# Altium schematic sheet Sheet1.SchDoc (part 1 of 3)
size C; SheetNumber: 1; SheetTotal: 1
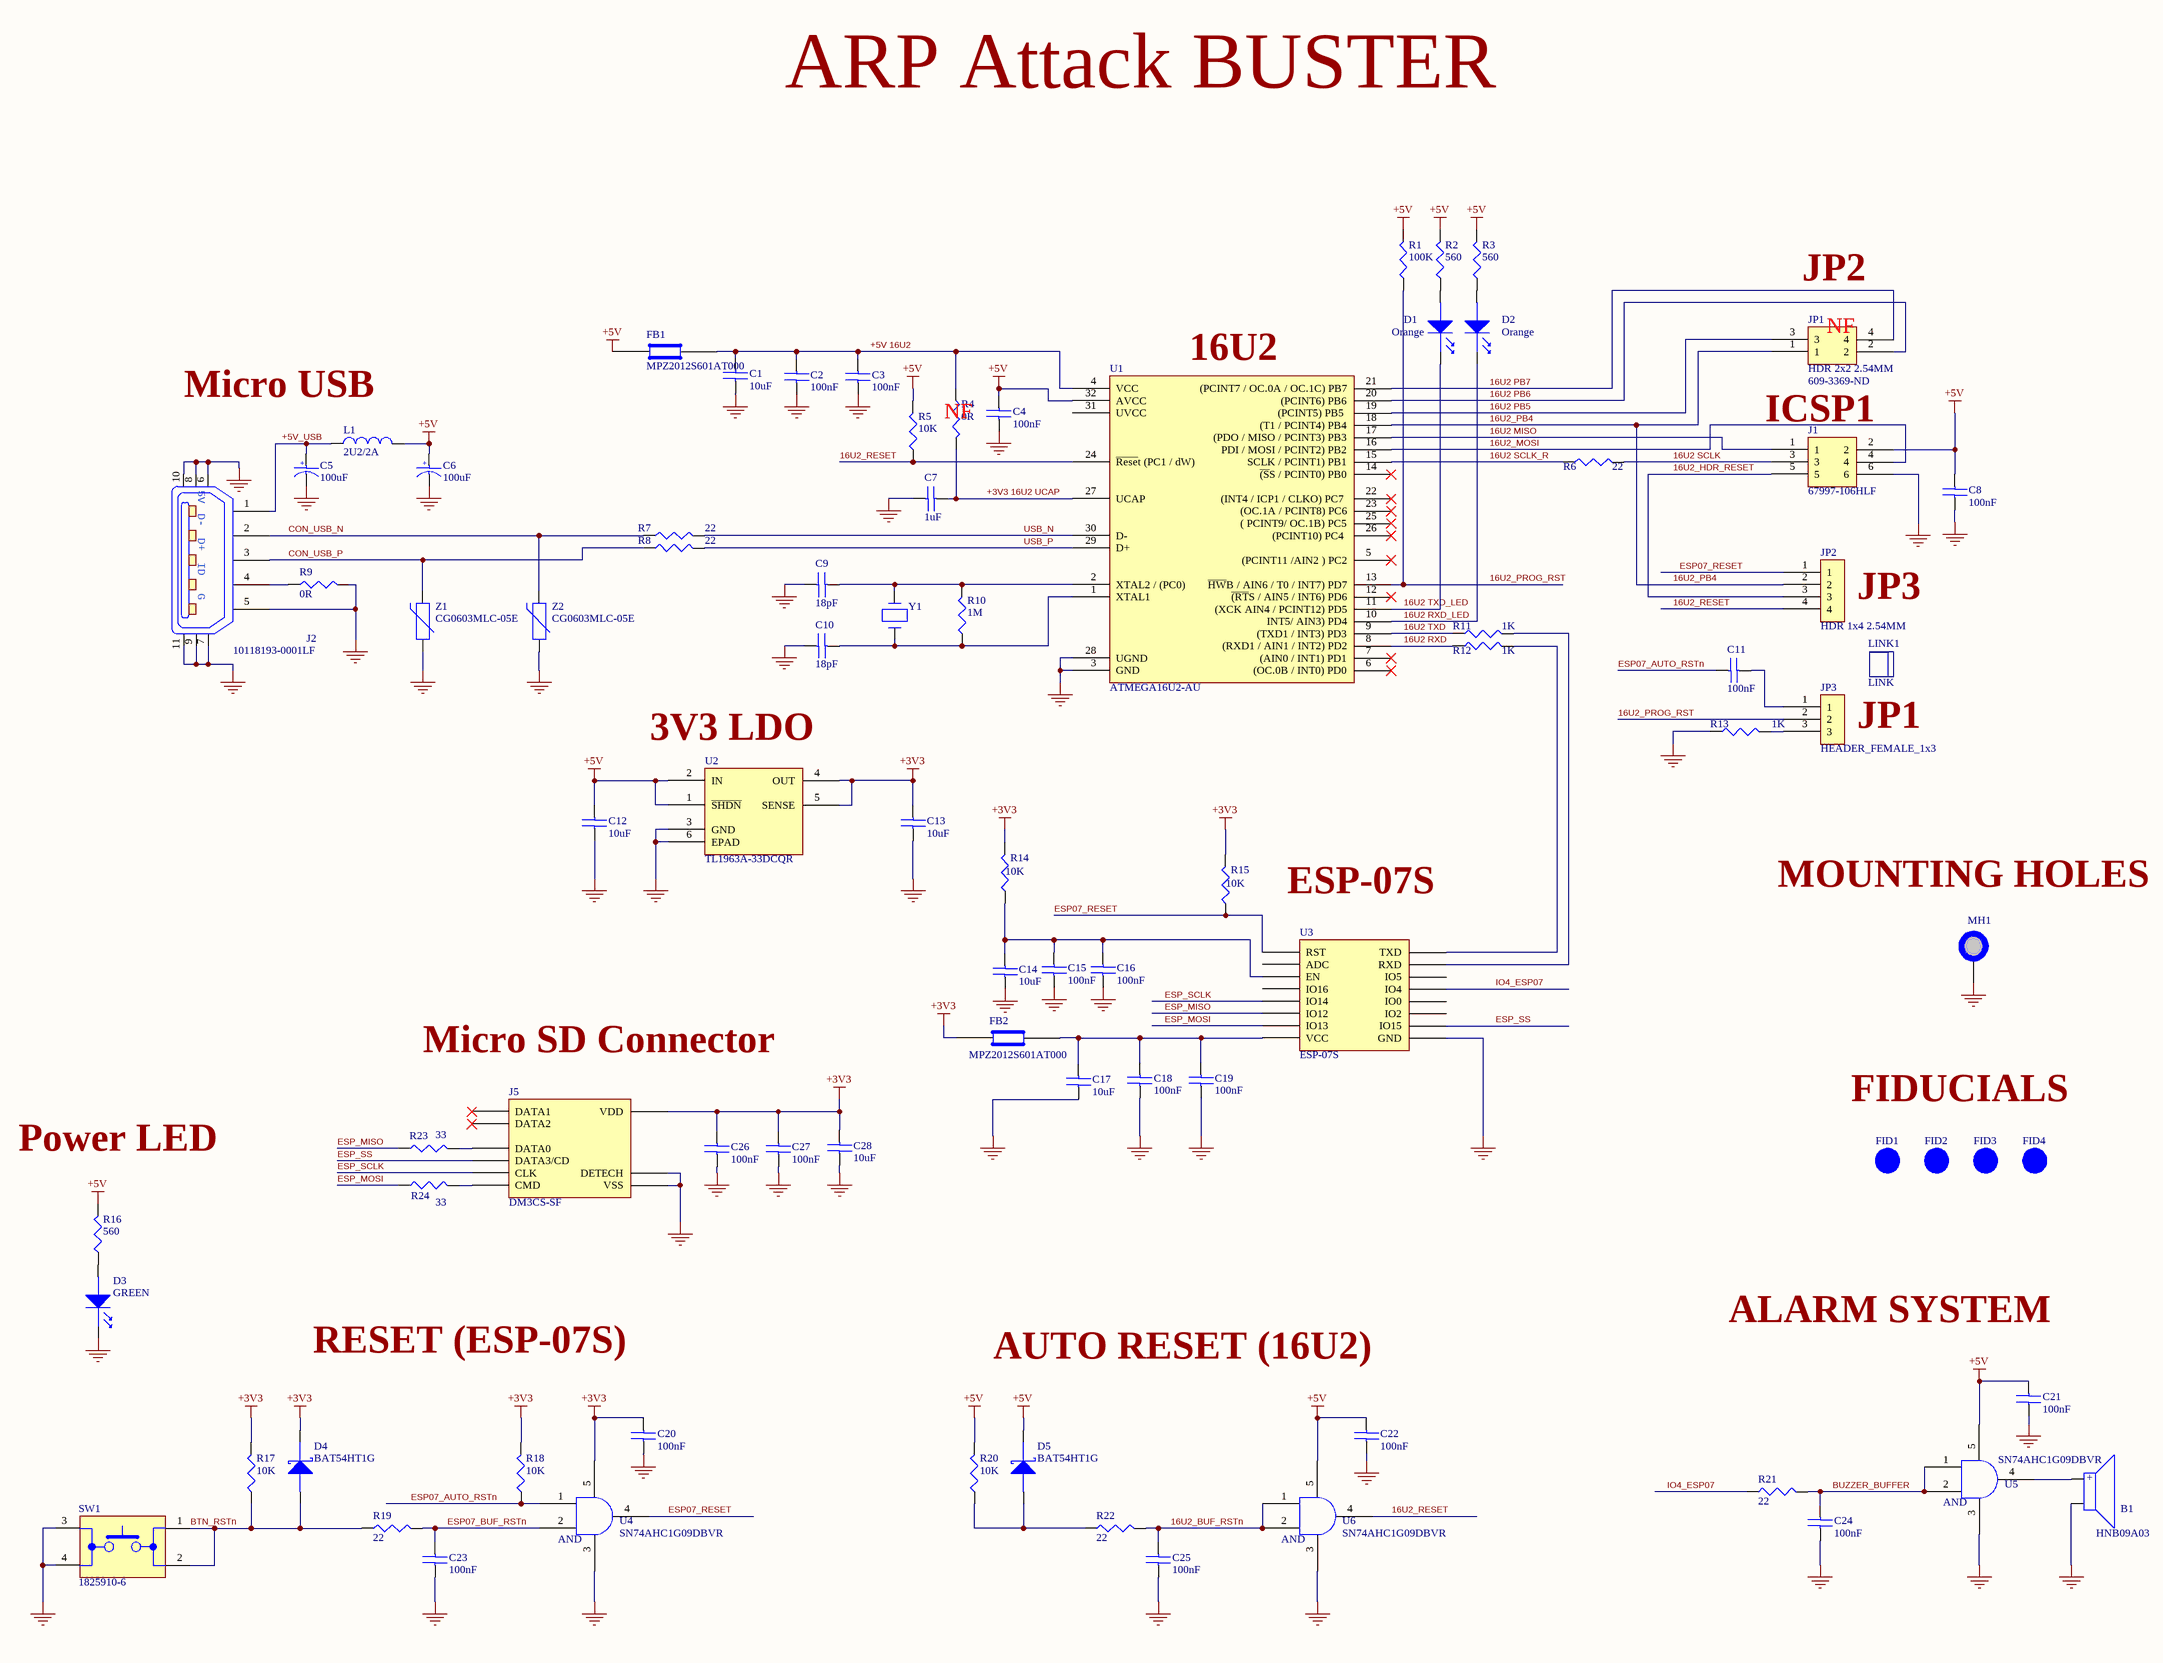
[diagram p0: Sheet1.SchDoc]

## Parts
B1  HNB09A03  [Buzzer_HNB09A03]
C1  10uF  [C0805]
C2  100nF  [C0805]
C3  100nF  [C0805]
C4  100nF  [C0805]
C5  100uF  [C_ALU_C_SIZE]
C6  100uF  [C_ALU_C_SIZE]
C7  1uF  [C0805]
C8  100nF  [C0805]
C9  18pF  [C0805]
C10  18pF  [C0805]
C11  100nF  [C0805]
C12  10uF  [C0805]
C13  10uF  [C0805]
C14  10uF  [C0805]
C15  100nF  [C0805]
C16  100nF  [C0805]
C17  10uF  [C0805]
C18  100nF  [C0805]
C19  100nF  [C0805]
C20  100nF  [C0805]
C21  100nF  [C0805]
C22  100nF  [C0805]
C23  100nF  [C0805]
C24  100nF  [C0805]
C25  100nF  [C0805]
C26  100nF  [C0805]
C27  100nF  [C0805]
C28  10uF  [C0805]
D1  Orange  [LED0603]
D2  Orange  [LED0603]
D3  GREEN  [LED0603]
D4  BAT54HT1G  [SOD323]
D5  BAT54HT1G  [SOD323]
FB1  MPZ2012S601AT000  [C0805]
FB2  MPZ2012S601AT000  [C0805]
FID1  FID_1MM  [FID_x_420]  (value not drawn)  (no BOM)
FID2  FID_1MM  [FID_x_420]  (value not drawn)  (no BOM)
FID3  FID_1MM  [FID_x_420]  (value not drawn)  (no BOM)
FID4  FID_1MM  [FID_x_420]  (value not drawn)  (no BOM)
J1  67997-106HLF  [HDR_2x3_2.54MM]
J2  10118193-0001LF  [10118193-0001LF]
J5  DM3CS-SF  [GCT_MEM2051-00-195-00-A]
JP1  HDR 2x2 2.54MM  Supplier Part Number 1: 609-3369-ND  [HDR_2x2_2.54MM]
JP2  HDR 1x4 2.54MM  [MALEHEADER_1x4_2.54MM]
JP3  HEADER_FEMALE_1x3  [HDR_1x3_2.54MM]
L1  2U2/2A  [CL_inductor]
LINK1  LINK  (mechanical)
MH1  Mounting_hole_17.4_3.2  [MH_17.4_3.2]  (value not drawn)  (no BOM)
R1  100K  [R0805]
R2  560  [R0805]
R3  560  [R0805]
R4  0R  [R0805]
R5  10K  [R0805]
R6  22  [R0805]
R7  22  [R0805]
R8  22  [R0805]
R9  0R  [R0805]
R10  1M  [R0805]
R11  1K  [R0805]
R12  1K  [R0805]
R13  1K  [R0805]
R14  10K  [R0805]
R15  10K  [R0805]
R16  560  [R0805]
R17  10K  [R0805]
R18  10K  [R0805]
R19  22  [R0805]
R20  10K  [R0805]
R21  22  [R0805]
R22  22  [R0805]
R23  33  [R0805]
R24  33  [R0805]
SW1  1825910-6  [DIP41825910-6]
U1  ATMEGA16U2-AU  [TQFP_32]
U2  TL1963A-33DCQR  [TL1963A-33DCQR]
U3  ESP-07S  [ESP-07S]
U4  SN74AHC1G09DBVR  [DBV_SOT_5]
U5  SN74AHC1G09DBVR  [DBV_SOT_5]
U6  SN74AHC1G09DBVR  [DBV_SOT_5]
Y1  ABM7-16.000MHZ-D2Y-T  [ABM4_v1_1_BIG]  (value not drawn)
Z1  CG0603MLC-05E  [R0603]
Z2  CG0603MLC-05E  [R0603]

## Nets
+3V3: C13.2 C20.2 C26.2 C27.2 C28.2 D4.1(Ca) FB2.1 J5.4(VDD) R14.2 R15.2 R17.2 R18.2 U2.4(OUT) U2.5(SENSE) U4.5
+5V: C4.2 C6.1 C8.2 C12.2 C21.2 C22.2 D5.1(Ca) FB1.1 J1.2 L1.2 R1.2 R2.2 R3.2 R5.2 R16.2 R20.2 U1.32(AVCC) U2.1(~{SHDN}) U2.2(IN) U5.5 U6.5
GND: B1.1 C1.1 C2.1 C3.1 C4.1 C5.2 C6.2 C7.1 C8.1 C9.1 C10.1 C12.1 C13.1 C14.1 C15.1 C16.1 C17.1 C18.1 C19.1 C20.1 C21.1 C22.1 C23.1 C24.1 C25.1 C26.1 C27.1 C28.1 D3.1(Ca) J1.6 J2.5 J2.6 J2.7 J2.8 J2.9 J2.10 J2.11 J5.6(VSS) J5.9(DETECH) MH1.1 R9.2 R13.1 SW1.3 SW1.4 U1.3(GND) U1.28(UGND) U2.3(GND) U2.6(EPAD) U3.9(GND) U4.3 U5.3 U6.3 Z1.1 Z2.1
16U2 MISO: J1.1 U1.17((PDO_/_MISO_/_PCINT3)_PB3)
16U2 PB5: JP1.3 U1.19((PCINT5)_PB5)
16U2 PB6: JP1.2 U1.20((PCINT6)_PB6)
16U2 PB7: JP1.4 U1.21((PCINT7_/_OC.0A_/_OC.1C)_PB7)
16U2 RXD: R12.1 U1.8((RXD1_/_AIN1_/_INT2)_PD2)
16U2 RXD_LED: D2.1(Ca) U1.10(INT5/_AIN3)_PD4)
16U2 SCLK: J1.3 R6.2
16U2 SCLK_R: R6.1 U1.15(SCLK_/_PCINT1)_PB1)
16U2 TXD: R11.1 U1.9((TXD1_/_INT3)_PD3)
16U2 TXD_LED: D1.1(Ca) U1.11((XCK_AIN4_/_PCINT12)_PD5)
16U2_BUF_RSTn: C25.2 R22.2 U6.1 U6.2
16U2_HDR_RESET: J1.5 JP2.3
16U2_MOSI: J1.4 U1.16(PDI_/_MOSI_/_PCINT2)_PB2)
16U2_PB4: JP1.1 JP2.2 U1.18((T1_/_PCINT4)_PB4)
16U2_PROG_RST: JP3.2 R1.1 U1.13(~{HW}B_/_AIN6_/_T0_/_INT7)_PD7)
16U2_RESET: JP2.4 R5.1 U1.24(~{Rese}t_(PC1_/_dW)) U6.4
+3V3 16U2 UCAP: C7.2 R4.2 U1.27(UCAP)
+5V 16U2: C1.2 C2.2 C3.2 FB1.2 R4.1 U1.4(VCC)
+5V_USB: C5.1 J2.1 L1.1
BTN_RSTn: D4.2(An) R17.1 R19.1 SW1.1 SW1.2
BUZZER_BUFFER: C24.2 R21.2 U5.1 U5.2
CON_USB_N: J2.2 R7.1 Z2.2
CON_USB_P: J2.3 R8.1 Z1.2
ESP07_AUTO_RSTn: C11.1 R18.1 U4.1
ESP07_BUF_RSTn: C23.2 R19.2 U4.2
ESP07_RESET: JP2.1 R15.1 U3.1(RST) U4.4
ESP_MISO: R23.1 U3.6(IO12)
ESP_MOSI: R24.1 U3.7(IO13)
ESP_SCLK: J5.5(CLK) U3.5(IO14)
ESP_SS: J5.2(DATA3/CD) U3.10(IO15)
IO4_ESP07: R21.1 U3.13(IO4)
USB_N: R7.2 U1.30(D-)
USB_P: R8.2 U1.29(D+)
NetB1_2: B1.2 U5.4
NetC9_2: C9.2 R10.2 U1.2(XTAL2_/_(PC0)) Y1.2
NetC10_2: C10.2 R10.1 U1.1(XTAL1) Y1.1
NetC11_2: C11.2 JP3.1
NetC14_2: C14.2 C15.2 C16.2 R14.1 U3.3(EN)
NetC17_2: C17.2 C18.2 C19.2 FB2.2 U3.8(VCC)
NetD1_2: D1.2(An) R2.1
NetD2_2: D2.2(An) R3.1
NetD3_2: D3.2(An) R16.1
NetD5_2: D5.2(An) R20.1 R22.1
NetJ2_4: J2.4 R9.1
NetJ5_3: J5.3(CMD) R24.2
NetJ5_7: J5.7(DATA0) R23.2
NetJP3_3: JP3.3 R13.2
NetR11_2: R11.2 U3.15(RXD)
NetR12_2: R12.2 U3.16(TXD)

Not connected (* = marked no-connect by the designer): J5 1(DATA2)* 8(DATA1)*; U1 5((PCINT11_/AIN2_)_PC2)* 6((OC.0B_/_INT0)_PD0)* 7((AIN0_/_INT1)_PD1)* 12(~{(RT}S_/_AIN5_/_INT6)_PD6)* 14(~{(S}S_/_PCINT0)_PB0)* 22((INT4_/_ICP1_/_CLKO)_PC7_)* 23((OC.1A_/_PCINT8)_PC6)* 25(_(_PCINT9/_OC.1B)_PC5)* 26((PCINT10)_PC4_)* 31(UVCC); U3 2(ADC) 4(IO16) 11(IO2) 12(IO0) 14(IO5)

## Notes on the sheet
- ARP Attack BUSTER
- JP2
- (near JP1) NF
- Micro USB
- (near U1) 16U2
- (near R4) NF
- (near J1) ICSP1
- JP3
- (near U2) 3V3 LDO
- JP1
- ESP-07S
- MOUNTING HOLES
- Micro SD Connector
- FIDUCIALS
- Power LED
- ALARM SYSTEM
- RESET (ESP-07S)
- AUTO RESET (16U2)
- (in symbol 10118193-0001LF) 5V; D-; D+; ID; G
- (in symbol EEE-1AA101WR) +
- (in symbol HNB09A03) +
- (in symbol SN74AHC1G09DBVR) AND